# EAGLE design main_board (EAGLE 6.1)
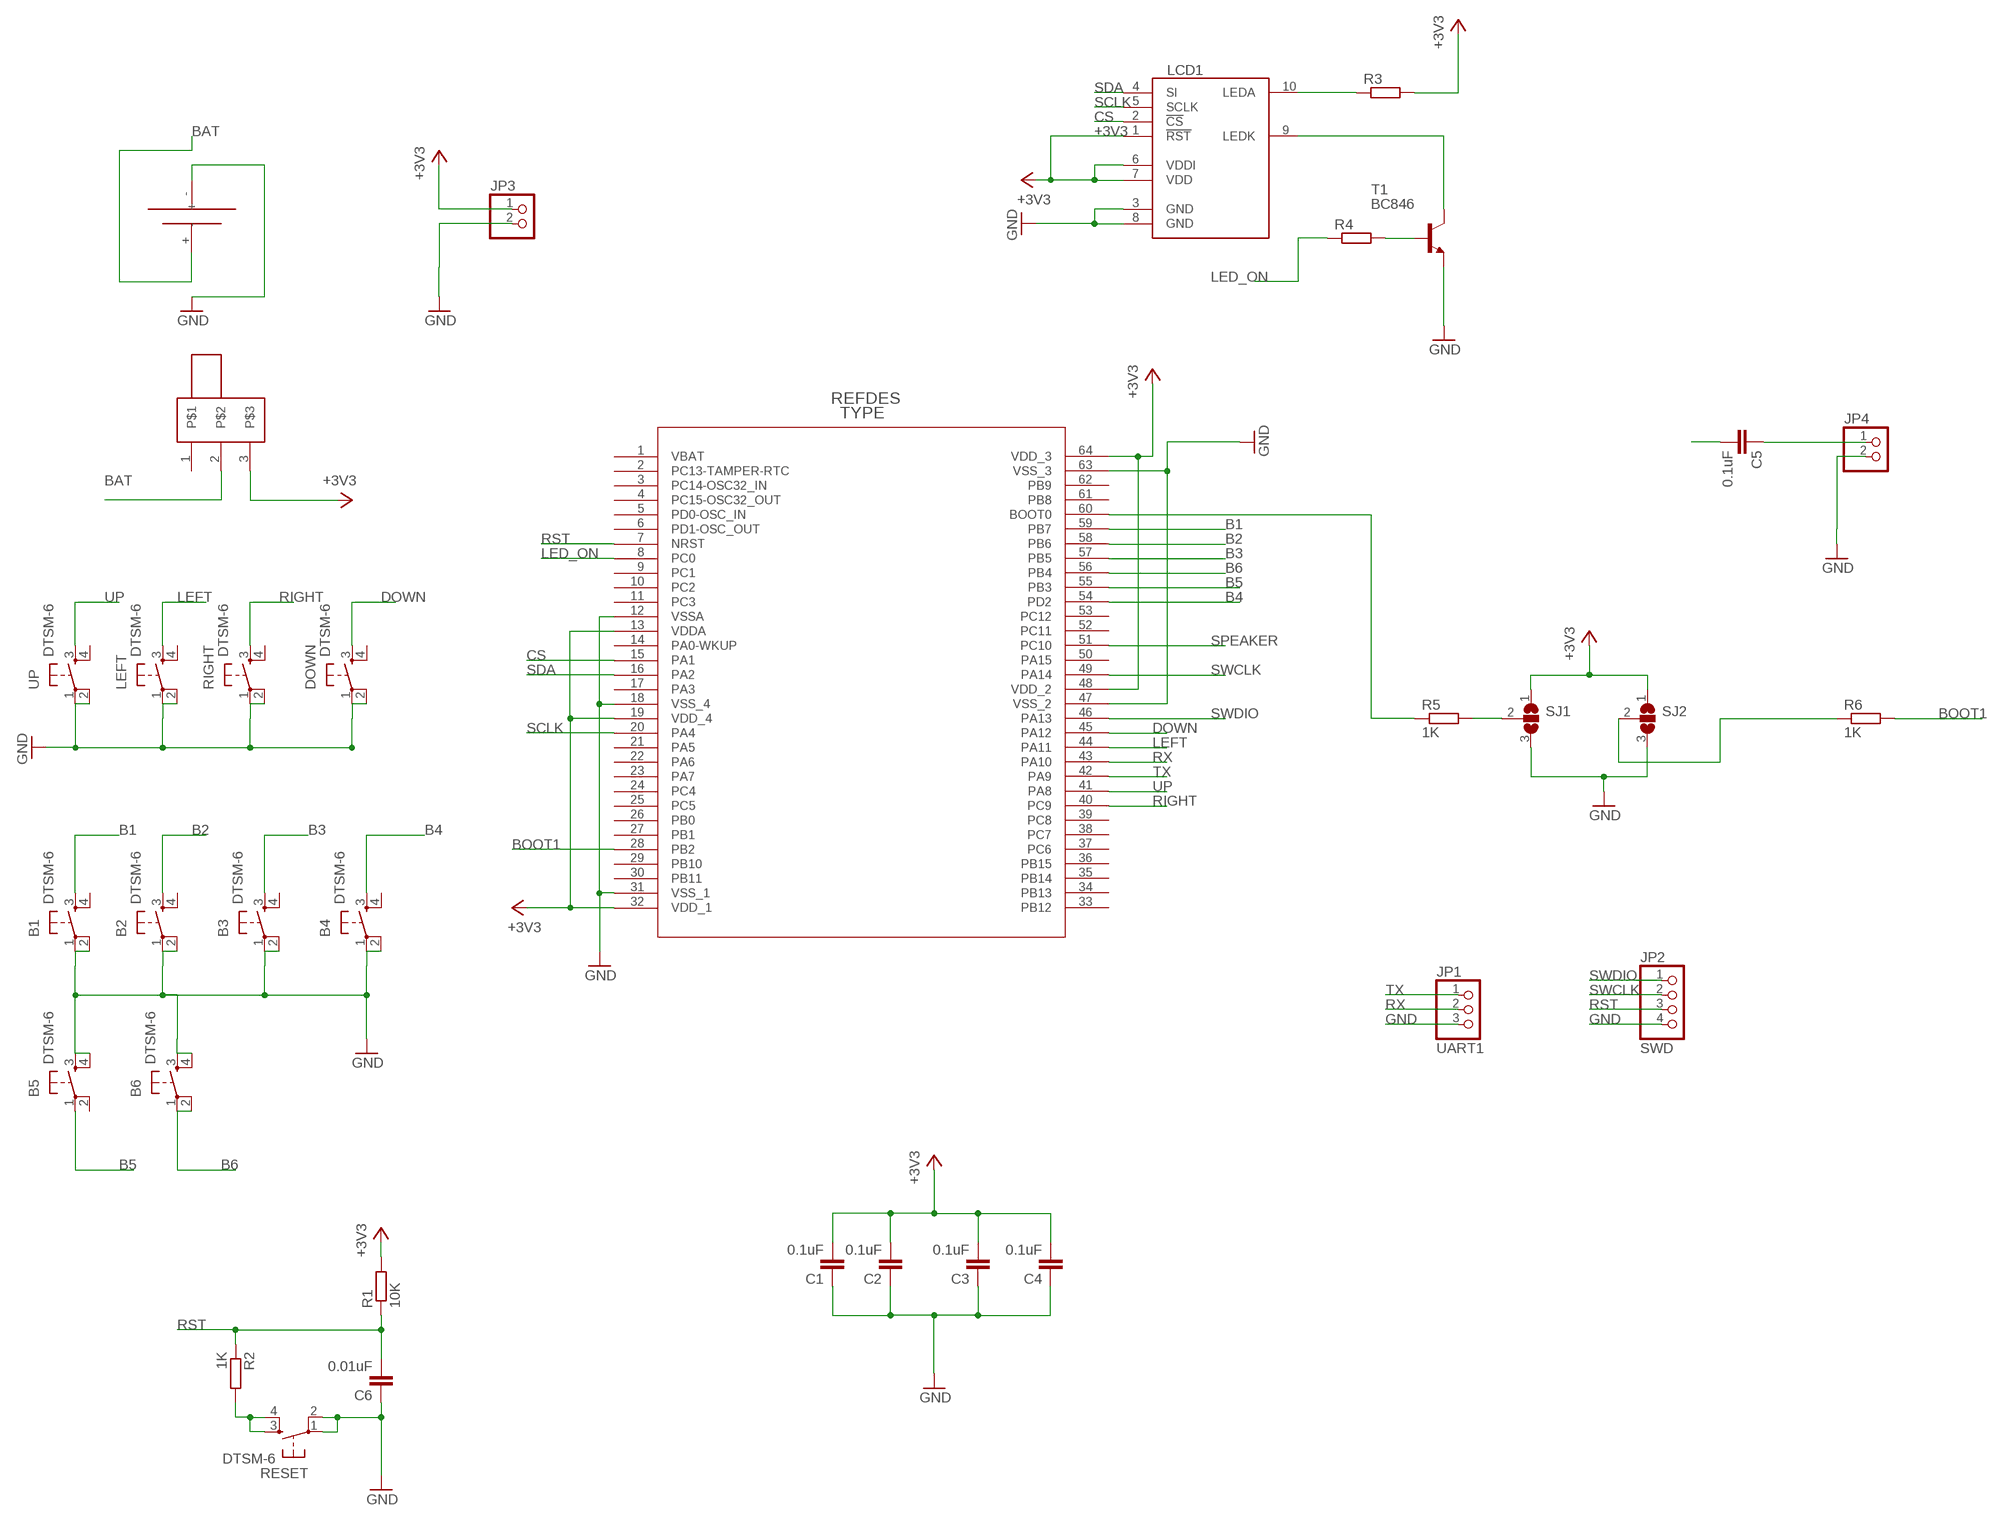
[diagram p0: schematic, sheet 1]

## Parts
B1  DTSM-6  [DTSM-6]
B2  DTSM-6  [DTSM-6]
B3  DTSM-6  [DTSM-6]
B4  DTSM-6  [DTSM-6]
B5  DTSM-6  [DTSM-6]
B6  DTSM-6  [DTSM-6]
C1  0.1uF  C-EUC1206  [C1206]
C2  0.1uF  C-EUC1206  [C1206]
C3  0.1uF  C-EUC1206  [C1206]
C4  0.1uF  C-EUC1206  [C1206]
C5  0.1uF  C-EUC1206  [C1206]
C6  0.01uF  C-EUC1206  [C1206]
DOWN  DTSM-6  [DTSM-6]
JP1  UART1  PINHD-1X3/90  [1X03/90]
JP2  SWD  PINHD-1X4/90  [1X04/90]
JP3  PINHD-1X2  [1X02]
JP4  PINHD-1X2  [1X02]
LCD1  LCD1202  [NOKIA1202LCD]
LEFT  DTSM-6  [DTSM-6]
R1  10K  R-EU_R1206  [R1206]
R2  1K  R-EU_R1206  [R1206]
R3  R-EU_R1206  [R1206]
R4  R-EU_R1206  [R1206]
R5  1K  R-EU_R1206  [R1206]
R6  1K  R-EU_R1206  [R1206]
RESET  DTSM-6  [DTSM-6]
RIGHT  DTSM-6  [DTSM-6]
SJ1  SJ2W  [SJ_2]
SJ2  SJ2W  [SJ_2]
T1  BC846  [SOT23]
U$1  STM32F100RBT6B  [LQFP-64]
U$2  BAT33  [3V3BATPACK]
U$3  SWITCH3  [SWITCH3]
UP  DTSM-6  [DTSM-6]

## Nets
+3V3: C1.2 C2.2 C3.2 C4.2 JP3.1 LCD1.1(!RST) LCD1.6(VDDI) LCD1.7(VDD) R1.2 R3.2 SJ1.1 SJ2.1 U$1.13(VDDA) U$1.19(VDD_4) U$1.32(VDD_1) U$1.48(VDD_2) U$1.64(VDD_3) U$3.3
B1: B1.3 U$1.59(PB7)
B2: B2.3 U$1.58(PB6)
B3: B3.3 U$1.57(PB5)
B4: B4.3 U$1.54(PD2)
B5: B5.1 U$1.55(PB3)
B6: B6.1 B6.2 U$1.56(PB4)
BAT: U$2.+ U$3.2
BOOT1: R6.2 U$1.28(PB2)
CS: LCD1.2(!CS) U$1.15(PA1)
DOWN: DOWN.3 U$1.45(PA12)
GND: B1.1 B1.2 B2.1 B2.2 B3.1 B3.2 B4.1 B4.2 B5.3 B5.4 B6.3 B6.4 C1.1 C2.1 C3.1 C4.1 C6.1 DOWN.1 DOWN.2 JP1.3 JP2.4 JP3.2 JP4.2 LCD1.3(GND) LCD1.8(GND) LEFT.1 LEFT.2 RESET.1 RESET.2 RIGHT.1 RIGHT.2 SJ1.3 SJ2.3 T1.2(E) U$1.12(VSSA) U$1.18(VSS_4) U$1.31(VSS_1) U$1.47(VSS_2) U$1.63(VSS_3) U$2.- UP.1 UP.2
LED_ON: R4.1 U$1.8(PC0)
LEFT: LEFT.3 U$1.44(PA11)
N$1: LCD1.9(LEDK) T1.3(C)
N$2: R4.2 T1.1(B)
N$3: R2.2 RESET.3 RESET.4
N$4: LCD1.10(LEDA) R3.1
N$5: R5.1 U$1.60(BOOT0)
N$6: R5.2 SJ1.2
N$8: C5.1 JP4.1
N$9: R6.1 SJ2.2
RIGHT: RIGHT.3 U$1.40(PC9)
RST: C6.2 JP2.3 R1.1 R2.1 U$1.7(NRST)
RX: JP1.2 U$1.43(PA10)
SCLK: LCD1.5(SCLK) U$1.20(PA4)
SDA: LCD1.4(SI) U$1.16(PA2)
SPEAKER: C5.2 U$1.51(PC10)
SWCLK: JP2.2 U$1.49(PA14)
SWDIO: JP2.1 U$1.46(PA13)
TX: JP1.1 U$1.42(PA9)
UP: U$1.41(PA8) UP.3
Unconnected: B1.4 B2.4 B3.4 B4.4 B5.2 DOWN.4 LEFT.4 RIGHT.4 U$1.1(VBAT) U$1.2(PC13-TAMPER-RTC) U$1.3(PC14-OSC32_IN) U$1.4(PC15-OSC32_OUT) U$1.5(PD0-OSC_IN) U$1.6(PD1-OSC_OUT) U$1.9(PC1) U$1.10(PC2) U$1.11(PC3) U$1.14(PA0-WKUP) U$1.17(PA3) U$1.21(PA5) U$1.22(PA6) U$1.23(PA7) U$1.24(PC4) U$1.25(PC5) U$1.26(PB0) U$1.27(PB1) U$1.29(PB10) U$1.30(PB11) U$1.33(PB12) U$1.34(PB13) U$1.35(PB14) U$1.36(PB15) U$1.37(PC6) U$1.38(PC7) U$1.39(PC8) U$1.50(PA15) U$1.52(PC11) U$1.53(PC12) U$1.61(PB8) U$1.62(PB9) U$3.1 UP.4

## Library data of the parts
B1-B6 DOWN LEFT RESET RIGHT UP = switch-tact:DTSM-6
C1-C6 = resistor:C-EU: CAPACITOR, European symbol
JP1 = pinhead:PINHD-1X3: PIN HEADER
JP2 = pinhead:PINHD-1X4: PIN HEADER
JP3 JP4 = pinhead:PINHD-1X2: PIN HEADER
LCD1 = lcd1202:LCD1202: 1.3" b/w graphics display 96x68 pixel. From Nokia 1202 cell phone
R1-R6 = resistor:R-EU_: RESISTOR, European symbol
SJ1 SJ2 = jumper:SJ2W: SMD solder JUMPER
T1 = transistor:BC846: NPN TRANSISTOR
U$1 = st:STM32F100RBT6B
U$2 = SashaLib:BAT33
U$3 = SashaLib:SWITCH3

## Board
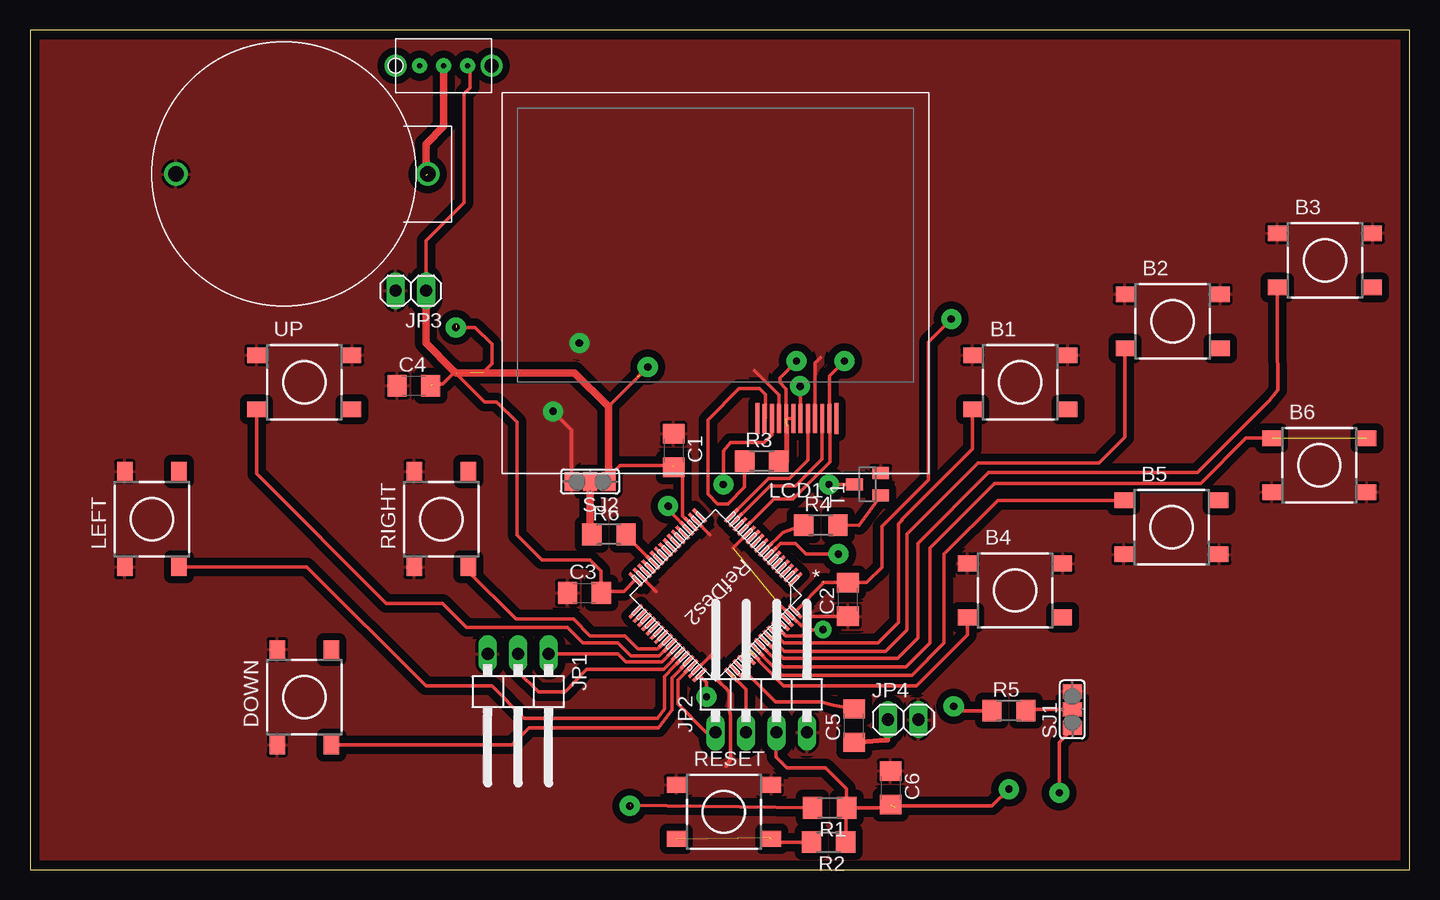
[diagram p1: board, top side]
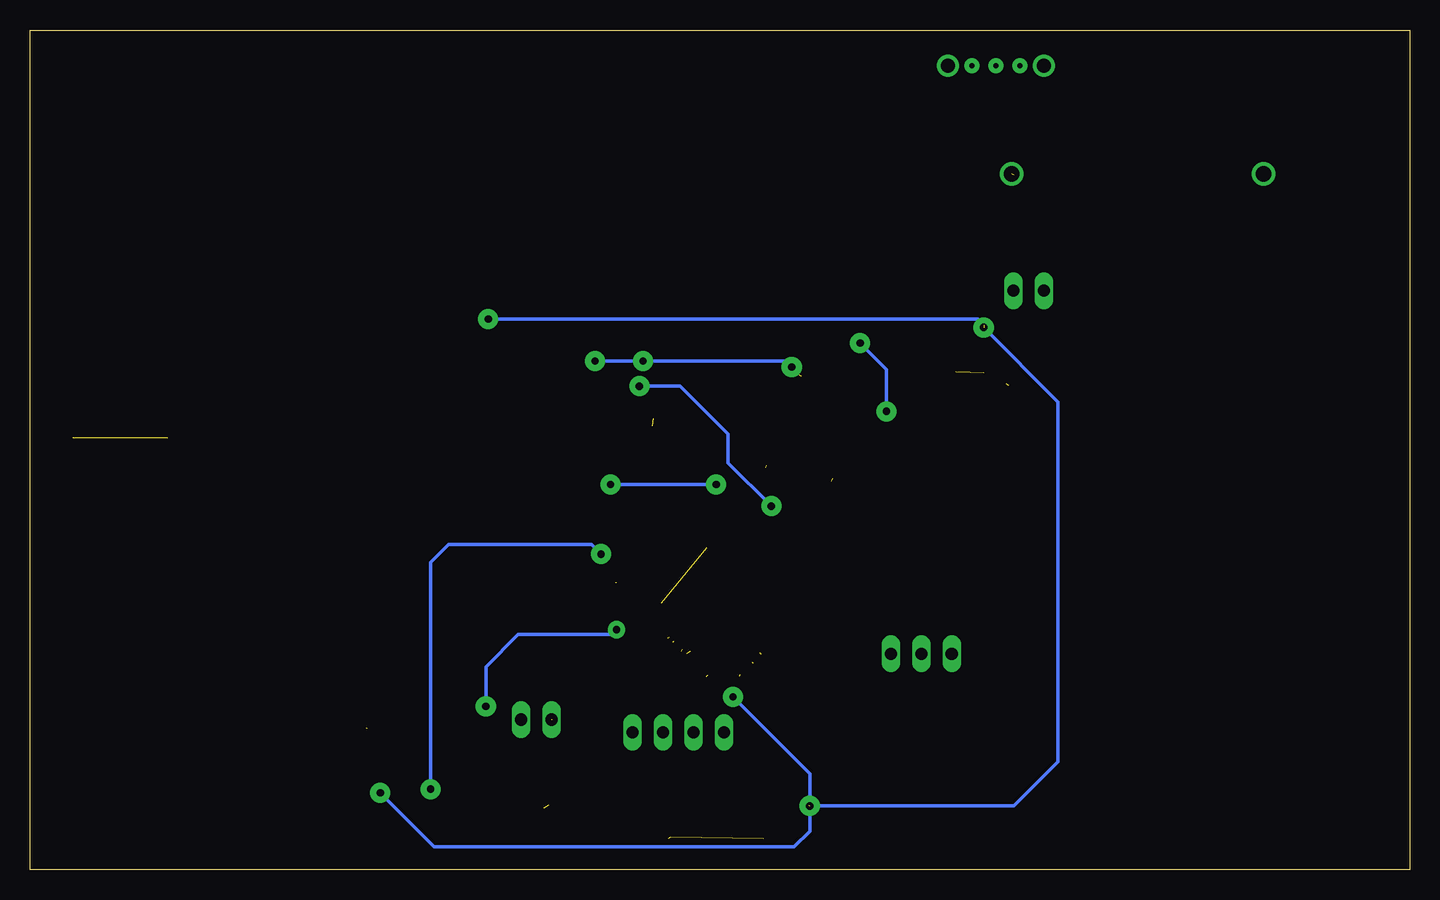
[diagram p2: board, bottom side, seen from below]

Size 115 x 70 mm. Coordinates in mm from the lower left corner, seen from the top.
Outline: 0,0 115,0 115,70 0,70 0,0
Copper layers (1*16): Top 0.035mm / dielectric 1.5mm / Bottom 0.035mm
Design rules: minimum track width 10mil, minimum drill 24mil, track to track 8mil, track to pad 8mil, pad to pad 8mil, via to via 8mil, smd to smd 8mil, copper to edge 30mil, drill to drill 8mil, minimum pad ring 10mil, minimum via ring 8mil, stop-mask expansion 4mil, vias tented up to drill 0mil, thermal gap 10mil

### Footprints (pad centres in the part's own frame; a part is rotated, then mirrored left to right if it is on the bottom)
DTSM-6 = smd 1.55 x 1.3: 1 -3.975,2.25; 2 3.975,2.25; 3 -3.975,-2.25; 4 3.975,-2.25
C1206 = smd 1.6 x 1.8: 1 -1.4,0; 2 1.4,0
1X03/90 = drill 1.016 long: 1 -2.54,-3.81; 2 0,-3.81; 3 2.54,-3.81
1X04/90 = drill 1.016 long: 1 -3.81,-3.81; 2 -1.27,-3.81; 3 1.27,-3.81; 4 3.81,-3.81
1X02 = drill 1.016 long: 1 -1.27,0; 2 1.27,0
NOKIA1202LCD = smd 0.32 x 2.6: 0 -10.09,14.478; 11 -3.49,14.478 | smd 0.32 x 2.4: 1 -9.49,14.478; 2 -8.89,14.478; 3 -8.29,14.478; 4 -7.69,14.478; 5 -7.09,14.478; 6 -6.49,14.478; 7 -5.89,14.478; 8 -5.29,14.478; 9 -4.69,14.478; 10 -4.09,14.478
R1206 = smd 1.6 x 1.803: 1 -1.422,0; 2 1.422,0
SJ_2 = smd 1.168 x 1.6: 1 -1.524,0; 2 0,0; 3 1.524,0
SOT23 = smd 1 x 1.4: 1 -0.95,-1.1; 2 0.95,-1.1; 3 0,1.1
LQFP-64 = smd 1.473 x 0.279: 1 -5.639,3.759; 2 -5.639,3.251; 3 -5.639,2.743; 4 -5.639,2.261; 5 -5.639,1.753; 6 -5.639,1.245; 7 -5.639,0.762; 8 -5.639,0.254; 9 -5.639,-0.254; 10 -5.639,-0.762; 11 -5.639,-1.245; 12 -5.639,-1.753; 13 -5.639,-2.261; 14 -5.639,-2.743; 15 -5.639,-3.251; 16 -5.639,-3.759; 33 5.639,-3.759; 34 5.639,-3.251; 35 5.639,-2.743; 36 5.639,-2.261; 37 5.639,-1.753; 38 5.639,-1.245; 39 5.639,-0.762; 40 5.639,-0.254; 41 5.639,0.254; 42 5.639,0.762; 43 5.639,1.245; 44 5.639,1.753; 45 5.639,2.261; 46 5.639,2.743; 47 5.639,3.251; 48 5.639,3.759 | smd 0.279 x 1.473: 17 -3.759,-5.639; 18 -3.251,-5.639; 19 -2.743,-5.639; 20 -2.261,-5.639; 21 -1.753,-5.639; 22 -1.245,-5.639; 23 -0.762,-5.639; 24 -0.254,-5.639; 25 0.254,-5.639; 26 0.762,-5.639; 27 1.245,-5.639; 28 1.753,-5.639; 29 2.261,-5.639; 30 2.743,-5.639; 31 3.251,-5.639; 32 3.759,-5.639; 49 3.759,5.639; 50 3.251,5.639; 51 2.743,5.639; 52 2.261,5.639; 53 1.753,5.639; 54 1.245,5.639; 55 0.762,5.639; 56 0.254,5.639; 57 -0.254,5.639; 58 -0.762,5.639; 59 -1.245,5.639; 60 -1.753,5.639; 61 -2.261,5.639; 62 -2.743,5.639; 63 -3.251,5.639; 64 -3.759,5.639
3V3BATPACK = drill 1.3: + 11,-23; - 11,-2
SWITCH3 = drill 0.4 pad 1.27: 1 2,2.25; 2 4,2.25; 3 6,2.25 | drill 1.2: NC 0,2.25; NC1 8,2.25

### Placement (x,y rotation side)
B1  82.55,40.64 0 top
B2  95.25,45.72 0 top
B3  107.95,50.8 0 top
B4  82.12,23.27 0 top
B5  95.15,28.54 0 top
B6  107.48,33.72 0 top
C1  53.65,34.94 270 top
C2  68.19,22.52 90 top
C3  46.22,23.06 0 top
C4  32,40.34 0 top
C5  68.7,12 90 top
C6  71.74,6.81 270 top
DOWN  22.86,14.36 90 top
JP1  40.7,14.18 180 top
JP2  60.96,15.24 0 top
JP3  31.75,48.26 180 top
JP4  72.8,12.5 0 top
LCD1  57.15,52.07 180 top
LEFT  10.16,29.21 90 top
R1  66.66,5.15 180 top
R2  66.58,2.28 180 top
R3  61,34.05 0 top
R4  65.92,28.71 0 top
R5  81.61,13.24 0 top
R6  48.26,27.94 0 top
RESET  57.85,4.81 0 top
RIGHT  34.29,29.21 90 top
SJ1  86.89,13.34 90 top
SJ2  46.69,32.35 180 top
T1  69.82,32.12 90 top
U$1  57.15,22.86 225 top
U$2  10.16,46.99 90 top
U$3  30.48,64.77 0 top
UP  22.86,40.64 0 top

### Tracks (layer width: path | path; a pad name or v marks a point on that pad's centre or on a via)
+3V3  (via drill 0.6 pad 1.68)  (11 unrouted)
  Top 0.305: U$1.13 62,30.9 63.6,30.9 66.7,34 66.7,37.53 LCD1.1 66.64,41.14 v67.9,42.4 | 33,48.24 JP3.1 33.02,52.42 36.2,55.6 36.2,64.7 36.7,65.2 36.7,66.8 U$3.3 | 35.5,41.4 35.3,41.4 34.4,40.5 33.6,40.5 | 35.15,41.75 37.9,39 38.9,39 40.6,37.3 40.6,27.9 42.7,25.8 46.7,25.8 47.62,24.88 C3.2 47.76,23.2 49.5,23.2 50.49,24.19 U$1.32 | R1.2 50.05,5.35 | v56.4,14.4 56.4,15.6 55.9,16.1 | v85.8,6.4 85.8,10.6 87,11.8 | v35.5,45.2 37.1,45.2 38.5,43.8 38.5,42.2 37.8,41.5 | 50.87,41.24 48.21,38.59 | 66.18,23.92 U$1.64 | v76.8,45.9 74.9,44 74.9,32.5 71,28.6 71,25.2 69.72,23.92 C2.2 66.12,23.92 66.1,23.9 | v63.9,42.4 62.5,41 62.5,40.6 63.04,40.06 LCD1.7 LCD1.6 | v51.5,41.9 50.7,41.1 | U$1.19 54.4,29.5 54.4,32.9 53.6,33.7 49.2,33.7 48.1,32.6
  Top 0.406: R3.2 63.1,34.05 63.1,37
  Top 0.61: SJ2.1 48.21,38.59 45.4,41.4 35.5,41.4 35.15,41.75 33,43.9 33,48.24
  Bottom 0.305: v50,5.3 50,8 v56.4,14.4 | v85.8,6.4 81.3,1.9 51.3,1.9 50,3.2 v50,5.3 | v50,5.3 33,5.3 29.3,9 29.3,39 v35.5,45.2 | v76.8,45.9 36,45.9 35.5,45.4 | v51.5,41.9 52,42.4 v63.9,42.4 v67.9,42.4
B1
  Top 0.305: B1.3 78.58,35.08 72.7,29.2 72.7,29.1 72.4,28.8 72.4,20.6 70.7,18.9 62.87,18.9 U$1.59
B2  (1 unrouted)
  Top 0.305: B2.3 91.28,36.08 89.1,33.9 79,33.9 73.1,28 73.1,20 71.3,18.2 62.9,18.2 61.8,19.3
B3  (1 unrouted)
  Top 0.305: B3.3 103.97,44.52 104,40 103.3,39.1 97.3,33.1 79.9,33.1 74,27.2 74,19.3 72.3,17.6 62.8,17.6 61.4,19
B4  (1 unrouted)
  Top 0.305: B4.3 78.14,19.55 73.9,15.3 62.8,15.3 60,18.2
B5  (1 unrouted)
  Top 0.305: B5.1 80.69,30.79 76.2,26.3 76.2,18.9 73.5,16.2 62.7,16.2 60.7,18.2
B6  (1 unrouted)
  Top 0.305: B6.1 101.37,35.97 97.6,32.2 80.4,32.2 75,26.8 75,18.9 73,16.9 62.75,16.9 U$1.56
BAT  (1 unrouted)
  Top 0.61: U$3.2 34.48,61.98 33,60.5 33,57.9
BOOT1
  Top 0.305: R6.2 49.68,27.85 U$1.28
CS
  Top 0.305: LCD1.2 66.04,34.24 63.8,32 61.69,32 U$1.15
DOWN  (1 unrouted)
  Top 0.305: DOWN.3 40.19,10.38 41.6,11.8 52.4,11.8 53.5,13.3 53.5,16 54,16.5 54.7,17.2
GND  (via drill 0.6 pad 1.68)  (1 unrouted)
  Top 0.305: U$1.47 55.47,16.57 56.9,18 56.9,17.8 57.2,17.5 57.2,16.1 57.2,15.9 58.3,14.8 58.3,13.2 58.4,12.9 58.4,9.2 58,8.6 | U$1.31 50.86,24.54 52.2,23.2 | U$1.18 55.46,29.14 56.7,27.9 | U$1.12 59.89,28.09 58.6,26.8 | 62.4,22.2 63.43,21.17 U$1.63 64.3,20.31 64.3,20.3 65.12,21.12 C2.1 | LCD1.3 65.44,42.24 65.9,42.7 | LCD1.8 62.44,39.56 60.4,41.6 | SJ2.3 45.17,36.63 v43.6,38.2 | v45.8,43.9 46.4,43.9 46.5,44
  Bottom 0.305: v43.6,38.2 43.6,41.7 v45.8,43.9
  pour Top (isolate 0.813): 0.2,69.8 114.8,69.8 114.8,0.2 0.2,0.2
LED_ON
  Top 0.305: R4.1 62.76,28.11 U$1.8
LEFT
  Top 0.305: LEFT.3 23.07,25.23 33,15.3 38.5,15.3 41.2,12.6 52.3,12.6 52.9,13.4 52.9,16.1 53.7,16.93 U$1.44
N$1  (via drill 0.6 pad 1.68)
  Top 0.305: LCD1.9 61.84,36.24 61.2,35.6 58.4,35.6 57.8,34.9 v57.8,32.1 | v66.6,32.1 67.4,32.1 67.42,32.12 T1.3
  Bottom 0.305: v57.8,32.1 65.9,32.1 v66.6,32.1
N$2
  Top 0.305: T1.1 69.12,28.69 R4.2
N$3  (2 unrouted)
  Top 0.305: R2.2 62.02,2.28 61.6,2.7
N$4
  Top 0.305: R3.1 59.58,31.88 58.2,30.5 57.3,30.5 56.5,31.3 56.5,37.5 59.1,40.1 60.8,40.1 61.3,39.6 61.3,37.65 LCD1.10
N$5  (via drill 0.6 pad 1.42, 0.6 pad 1.68)
  Top 0.305: R5.1 77.36,13.24 v77,13.6 | v66.1,20 65.2,20 64.3,19.5 62.99,19.5 U$1.60
  Bottom 0.305: v77,13.6 77,16.9 74.3,19.6 65.8,19.6 v66.1,20
N$6
  Top 0.305: SJ1.2 83.13,13.34 R5.2
N$7
  pour Top (isolate 0.61): 0.2,69.8 114.7,69.8 114.7,0.2 0.2,0.2
N$8  (1 unrouted)
  Top 0.406: C5.1 71.3,10.8 71.5,10.8 71.5,12.5
N$9
  Top 0.305: 46.69,28.09 R6.1
  Top 0.61: SJ2.2 46.69,28.09
RIGHT
  Top 0.305: RIGHT.3 36.54,24.86 40.5,20.9 45.3,20.9 46.7,19.5 49.6,19.5 50.7,18.4 52.33,18.4 U$1.40
RST  (via drill 0.6 pad 1.68)  (1 unrouted)
  Top 0.305: R2.1 68,5.07 R1.1 | R1.1 72.15,5.15 72.3,5.3 80.2,5.3 v81.6,6.7 | v67.4,26.3 64.7,26.3 63.8,27.2 62.57,27.2 U$1.7 | R1.1 68.08,6.72 66.3,8.5 63.1,8.5 62.2,9.4 62.2,11.4 JP2.3
  Bottom 0.305: v81.6,6.7 81.6,25.6 80.1,27.1 68.2,27.1 v67.4,26.3
RX  (1 unrouted)
  Top 0.305: JP1.2 40.7,16.5 42.4,14.8 44.6,14.8 46.4,16.7 52.8,16.7 54.2,18.1
SCLK  (via drill 0.6 pad 1.68)
  Top 0.305: LCD1.5 64.24,40.26 v64.2,40.3 | v53.2,30.3 53.2,30.01 U$1.20
  Bottom 0.305: v64.2,40.3 60.8,40.3 56.8,36.3 56.8,33.9 v53.2,30.3
SDA
  Top 0.305: LCD1.4 64.84,34.14 63.3,32.6 61.57,32.6 U$1.16
SPEAKER
  Top 0.305: C5.2 67,13.7 65.9,14 62.13,14 U$1.51
SWCLK  (1 unrouted)
  Top 0.305: JP2.2 59.69,15.01 58.6,16.1
SWDIO
  Top 0.305: JP2.1 56.37,11.43 54,13.8 54,15.83 U$1.46
TX
  Top 0.305: JP1.1 49.01,17.99 49.7,17.3 52.67,17.3 U$1.42
UP
  Top 0.305: UP.3 18.89,33.02 29.7,22.2 34.4,22.2 36.4,20.2 44.8,20.2 46.1,18.9 49,18.9 50.1,17.8 52.45,17.8 U$1.41